# EAGLE design 0_2a (EAGLE 7.6.0)
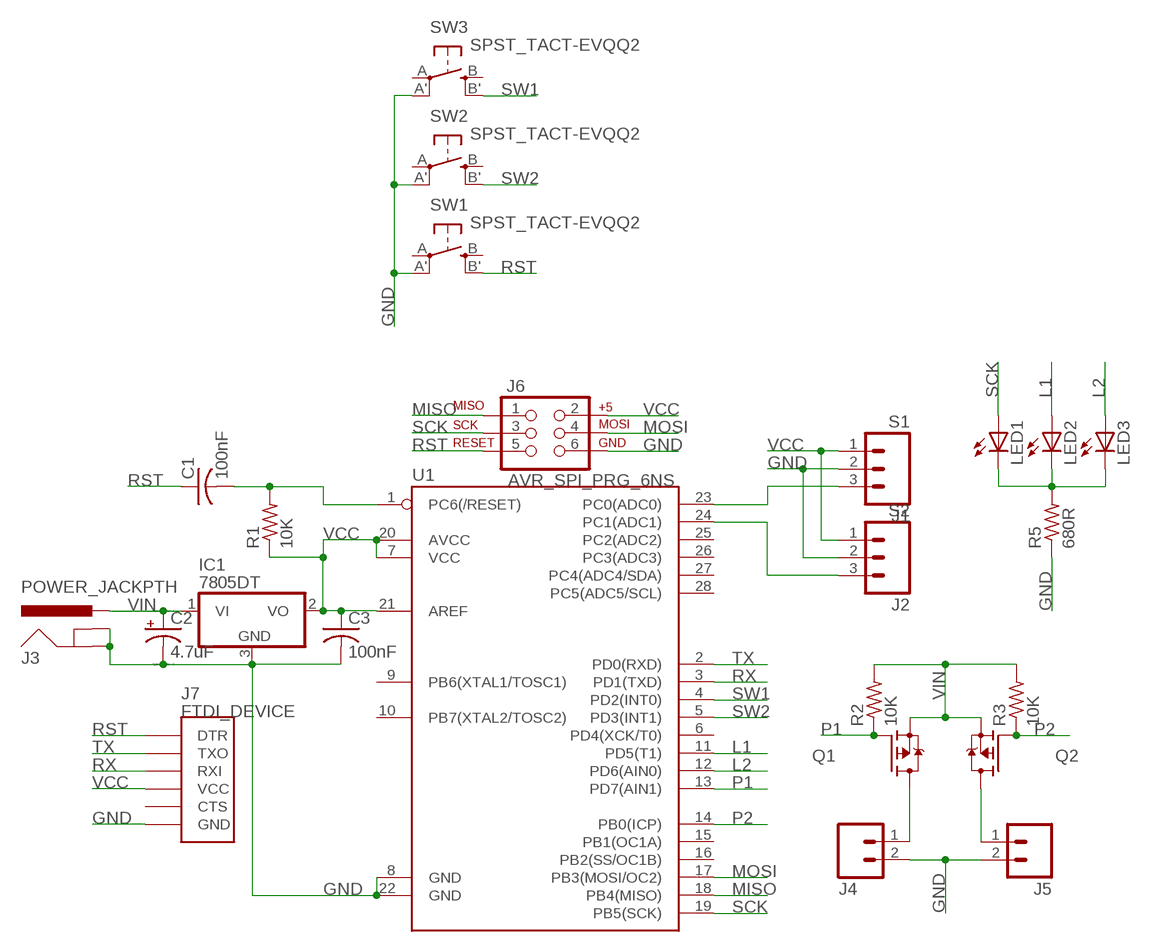
[diagram p0: schematic, sheet 1]

## Parts
C1  100nF  C-USC1206K  [C1206K]
C2  4.7uF  CPOL-US153CLV-0405  [153CLV-0405]
C3  100nF  C-USC1206K  [C1206K]
IC1  7805DT  [TO252]
J1  S1  M03POLAR  [MOLEX-1X3]
J2  S2  M03POLAR  [MOLEX-1X3]
J3  POWER_JACKPTH  [POWER_JACK_PTH]
J4  M02POLAR  [MOLEX-1X2]
J5  M02POLAR  [MOLEX-1X2]
J6  AVR_SPI_PRG_6NS  [2X3-NS]
J7  FTDI_DEVICE  [FTDI_DEVICE_SIDE]
LED1  LED3MM  [LED3MM]
LED2  LED3MM  [LED3MM]
LED3  LED3MM  [LED3MM]
Q1  FDD4141TO252  [TO252]
Q2  FDD4141TO252  [TO252]
R1  10K  R-US_R0805  [R0805]
R2  10K  R-US_R0805  [R0805]
R3  10K  R-US_R0805  [R0805]
R5  680R  R-US_R0805  [R0805]
SW1  SPST_TACT-EVQQ2  [EVQ-Q2]
SW2  SPST_TACT-EVQQ2  [EVQ-Q2]
SW3  SPST_TACT-EVQQ2  [EVQ-Q2]
U1  ATMEGA328P_PDIP  [DIL28-3]

## Nets
GND: C2.- C3.2 IC1.3(GND) J1.2 J2.2 J3.GND J3.GNDBREAK J4.2 J5.2 J6.6 J7.P$6(GND) R5.1 SW1.A'(P1) SW2.A'(P1) SW3.A'(P1) U1.8(GND) U1.22(GND)
L1: LED2.A U1.11(PD5(T1))
L2: LED3.A U1.12(PD6(AIN0))
MISO: J6.1 U1.18(PB4(MISO))
MOSI: J6.4 U1.17(PB3(MOSI/OC2))
N$1: J1.3 U1.23(PC0(ADC0))
N$2: J2.3 U1.24(PC1(ADC1))
N$3: C1.2 R1.2 U1.1(PC6(/RESET))
N$4: J4.1 Q1.3(D)
N$5: J5.1 Q2.3(D)
N$10: LED1.K(C) LED2.K(C) LED3.K(C) R5.2
P1: Q1.1(G) R2.1 U1.13(PD7(AIN1))
P2: Q2.1(G) R3.1 U1.14(PB0(ICP))
RST: C1.1 J6.5 J7.P$1(DTR) SW1.B'(S1)
RX: J7.P$3(RXI) U1.3(PD1(TXD))
SCK: J6.3 LED1.A U1.19(PB5(SCK))
SW1: SW3.B'(S1) U1.4(PD2(INT0))
SW2: SW2.B'(S1) U1.5(PD3(INT1))
TX: J7.P$2(TXO) U1.2(PD0(RXD))
VCC: C3.1 IC1.2(VO) J1.1 J2.1 J6.2 J7.P$4(VCC) R1.1 U1.7(VCC) U1.20(AVCC) U1.21(AREF)
VIN: C2.+ IC1.1(VI) J3.PWR Q1.2(S) Q2.2(S) R2.2 R3.2
Unconnected: J7.P$5(CTS) SW1.A(P) SW1.B(S) SW2.A(P) SW2.B(S) SW3.A(P) SW3.B(S) U1.6(PD4(XCK/T0)) U1.9(PB6(XTAL1/TOSC1)) U1.10(PB7(XTAL2/TOSC2)) U1.15(PB1(OC1A)) U1.16(PB2(SS/OC1B)) U1.25(PC2(ADC2)) U1.26(PC3(ADC3)) U1.27(PC4(ADC4/SDA)) U1.28(PC5(ADC5/SCL))

## Library data of the parts
C1 = rcl:C-US: CAPACITOR, American symbol
C2 = resistor:CPOL-US: POLARIZED CAPACITOR, American symbol
C3 = resistor:C-US: CAPACITOR, American symbol
IC1 = linear:78*: Positive VOLTAGE REGULATOR Source: http://cache.national.com/ds/LM/LM78L05.pdf http://www.fairchildsemi.com/ds/LM/LM7805.pdf
J1 J2 = SparkFun-Connectors:M03: Header 3 Standard 3-pin 0.1" header. Use with straight break away headers (SKU : PRT-00116), right angle break away headers (PRT-00553), swiss pins (PRT-00743), machine pins (PRT-00117), and female headers (PRT-00115). Molex polarized connector foot print use with SKU : PRT-08232 with associated crimp pins and housings.
J3 = SparkFun-Connectors:POWER_JACK: Power Jack This is the standard 5.5mm barrel jack for power. The PTH is the most common, proven, reliable, footprint. The Slot footprint only works if the mill layer is transmitted to the PCB fab house so be warned. Mating wall wart : TOL-00298 (and others); PROD_ID: CONN-08197
J4 J5 = SparkFun-Connectors:M02: Standard 2-pin 0.1" header. Use with - straight break away headers ( PRT-00116) - right angle break away headers (PRT-00553) - swiss pins (PRT-00743) - machine pins (PRT-00117) - female headers (PRT-00115) Molex polarized connector foot print use with: PRT-08233 with associated crimp pins and housings. 2.54_SCREWTERM for use with PRT-10571. 3.5mm Screw Terminal footprints for PRT-08084 5mm Screw Terminal footprints for use with PRT-08432
J6 = SparkFun-Connectors:AVR_SPI_PRG_6: AVR ISP 6 Pin This is the reduced ISP connector for AVR programming. Common on Arduino. This footprint will take up less PCB space and can be used with a 10-pin to 6-pin adapter such as SKU: BOB-08508 **Special note about "TEST_POINT" package. The stop mask is on the top side, so if you want your programming test points to be on the bottom of your board, make sure to place this package on the bottom side of the board. This also ensure that the orientation to program from the bottom side will be correct.
J7 = SparkFun-Connectors:FTDI_DEVICE: Connector which mates to FTDI basic or FTDI cable.
LED1-LED3 = led:LED: LED OSRAM: - CHIPLED LG R971, LG N971, LY N971, LG Q971, LY Q971, LO R971, LY R971 LH N974, LH R974 LS Q976, LO Q976, LY Q976 LO Q996 - Hyper CHIPLED LW Q18S LB Q993, LB Q99A, LB R99A - SideLED LS A670, LO A670, LY A670, LG A670, LP A670 LB A673, LV A673, LT A673, LW A673 LH A674 LY A675 LS A676, LA A676, LO A676, LY A676, LW A676 LS A679, LY A679, LG A679 - Hyper Micro SIDELED® LS Y876, LA Y876, LO Y876, LY Y876 LT Y87S - SmartLED LW L88C, LW L88S LB L89C, LB L89S, LG L890 LS L89K, LO L89K, LY L89K LS L896, LA L896, LO L896, LY L896 - TOPLED LS T670, LO T670, LY T670, LG T670, LP T670 LSG T670, LSP T670, LSY T670, LOP T670, LYG T670 LG T671, LOG T671, LSG T671 LB T673, LV T673, LT T673, LW T673 LH T674 LS T676, LA T676, LO T676, LY T676, LB T676, LH T676, LSB T676, LW T676 LB T67C, LV T67C, LT T67C, LS T67K, LO T67K, LY T67K, LW E67C LS E67B, LA E67B, LO E67B, LY E67B, LB E67C, LV E67C, LT E67C LW T67C LS T679, LY T679, LG T679 LS T770, LO T770, LY T770, LG T770, LP T770 LB T773, LV T773, LT T773, LW T773 LH T774 LS E675, LA E675, LY E675, LS T675 LS T776, LA T776, LO T776, LY T776, LB T776 LHGB T686 LT T68C, LB T68C - Hyper Mini TOPLED® LB M676 - Mini TOPLED Santana® LG M470 LS M47K, LO M47K, LY M47K Source: http://www.osram.convergy.de LUXEON: - LUMILED® LXK2-PW12-R00, LXK2-PW12-S00, LXK2-PW14-U00, LXK2-PW14-V00 LXK2-PM12-R00, LXK2-PM12-S00, LXK2-PM14-U00 LXK2-PE12-Q00, LXK2-PE12-R00, LXK2-PE12-S00, LXK2-PE14-T00, LXK2-PE14-U00 LXK2-PB12-K00, LXK2-PB12-L00, LXK2-PB12-M00, LXK2-PB14-N00, LXK2-PB14-P00, LXK2-PB14-Q00 LXK2-PR12-L00, LXK2-PR12-M00, LXK2-PR14-Q00, LXK2-PR14-R00 LXK2-PD12-Q00, LXK2-PD12-R00, LXK2-PD12-S00 LXK2-PH12-R00, LXK2-PH12-S00 LXK2-PL12-P00, LXK2-PL12-Q00, LXK2-PL12-R00 Source: www.luxeon.com KINGBRIGHT: KA-3528ASYC Source: www.kingbright.com
Q1 Q2 = transistor-fet:FDD4141: P-Channel PowerTrench® MOSFET Source: FDD4141.pdf
R1-R3 = rcl:R-US_: RESISTOR, American symbol
R5 = resistor:R-US_: RESISTOR, American symbol
SW1-SW3 = adafruit:SPST_TACT: SMT 6mm switch, EVQQ2 series http://www.ladyada.net/library/eagle
U1 = SparkFun-DigitalIC:ATMEGA328P_PDIP: uC used in the Arduino 32kb flash, 1k EEPROM, 2k SRAM This is the through-hole version of this chip.

## Board
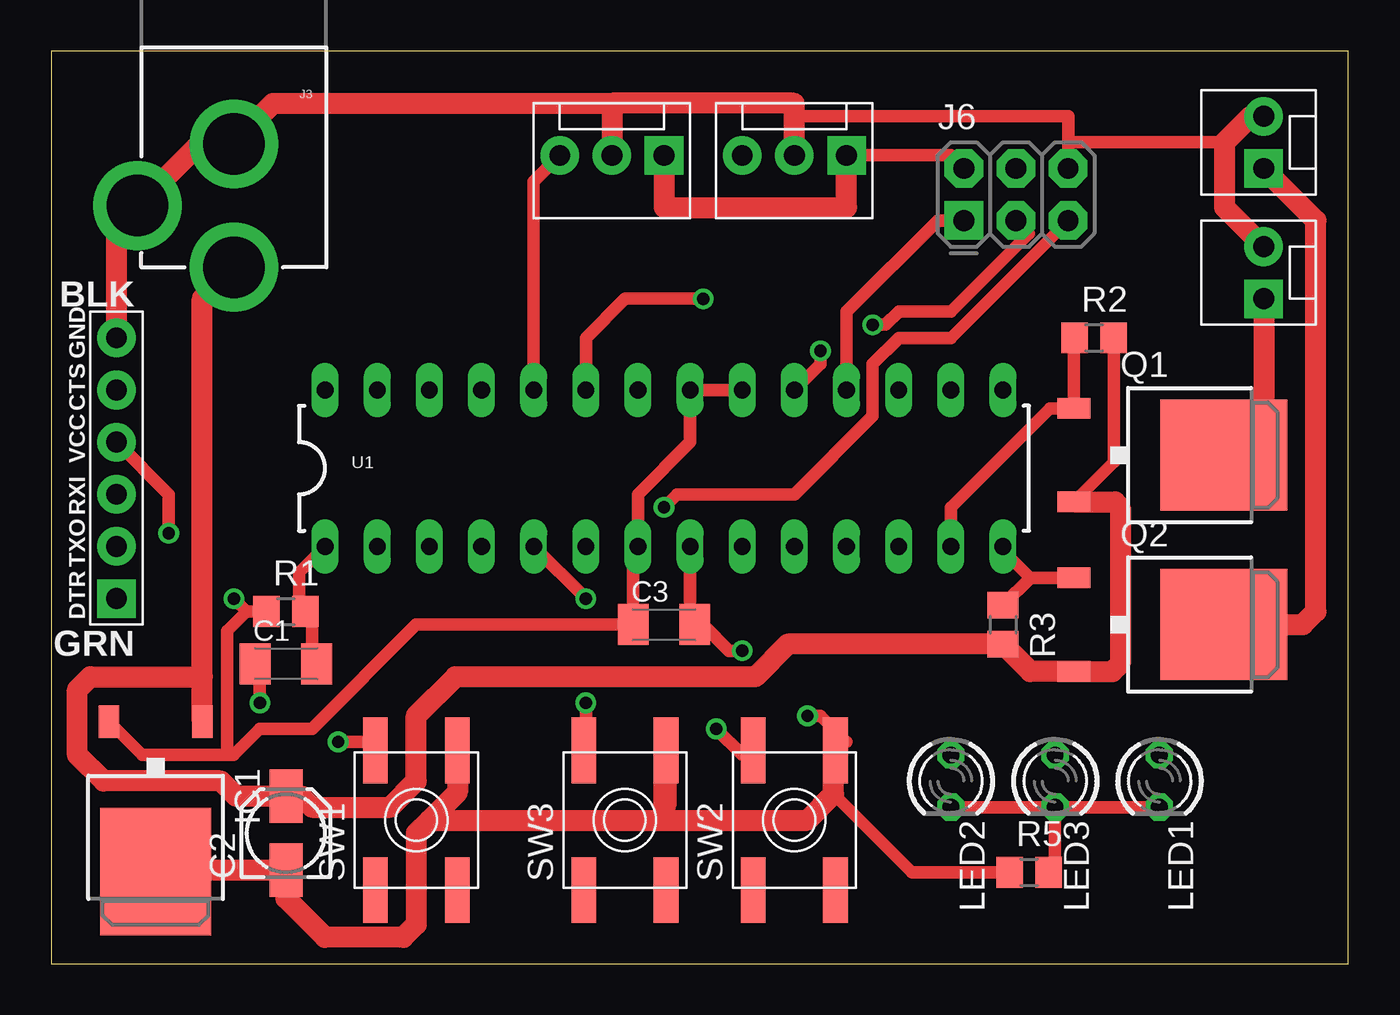
[diagram p1: board, top side]
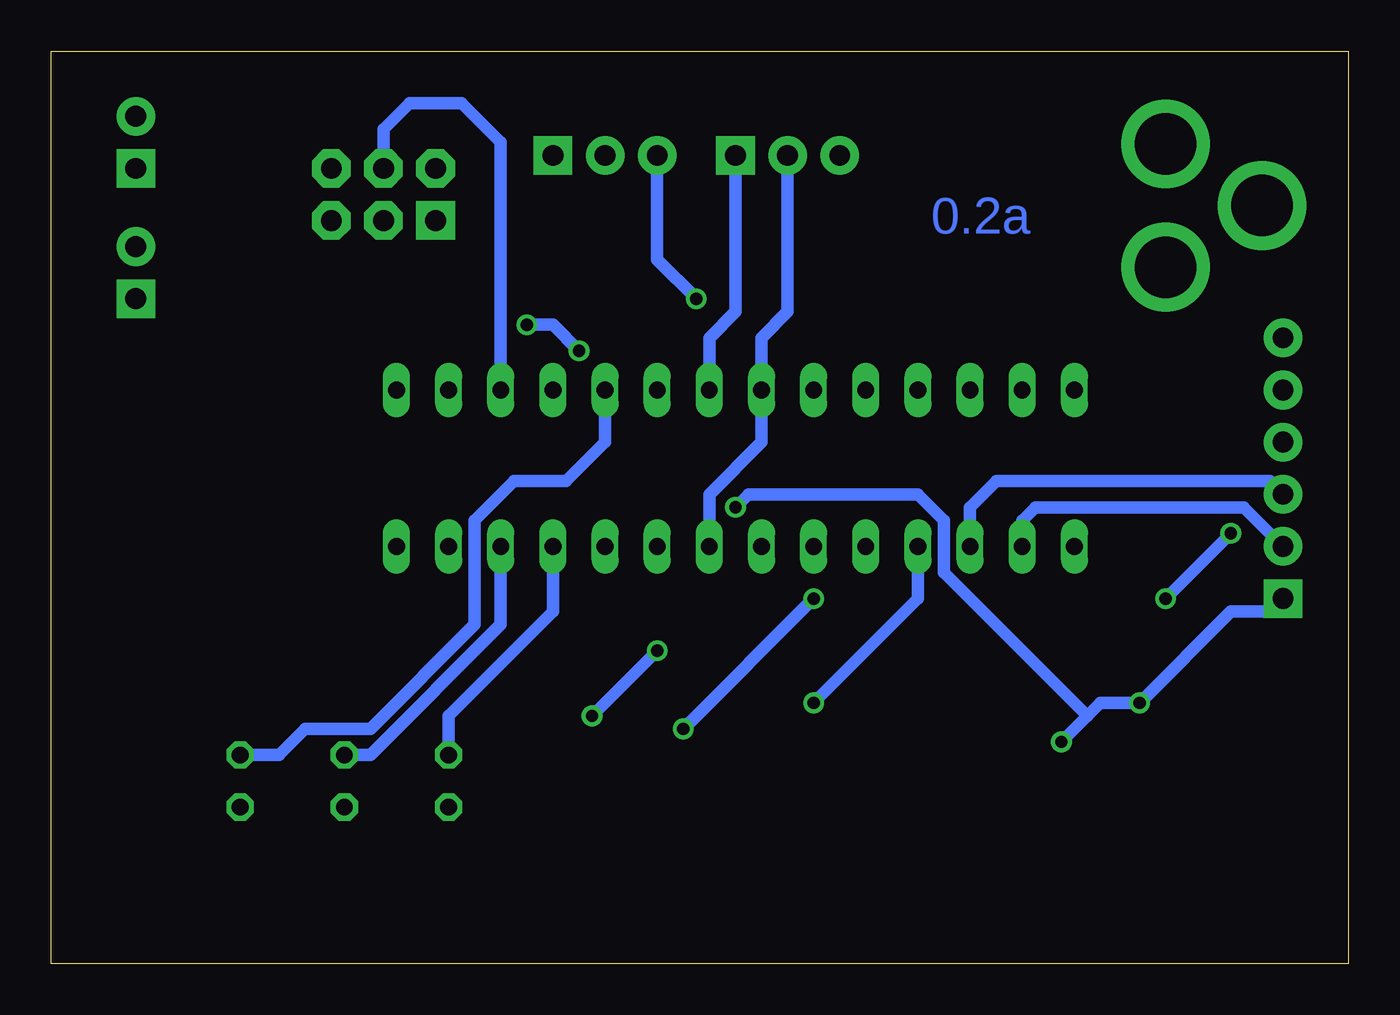
[diagram p2: board, bottom side, seen from below]

Size 63.17 x 44.44 mm. Coordinates in mm from the lower left corner, seen from the top.
Outline: 0,0 63.17,0 63.17,44.44 0,44.44 0,0
Copper layers (1*16): Top 0.035mm / dielectric 1.5mm / Bottom 0.035mm
Design rules "default": minimum track width 10mil, minimum drill 24mil, track to track 8mil, track to pad 8mil, pad to pad 8mil, via to via 8mil, smd to smd 8mil, copper to edge 40mil, drill to drill 8mil, minimum pad ring 10mil, minimum via ring 8mil, stop-mask expansion 4mil, vias tented up to drill 0mil, thermal gap 10mil

### Footprints (pad centres in the part's own frame; a part is rotated, then mirrored left to right if it is on the bottom)
C1206K = smd 1.5 x 2: 1 -1.5,0; 2 1.5,0
153CLV-0405 = smd 2.6 x 1.6: + 1.8,0; - -1.8,0
TO252 = smd 1 x 1.6: 1 -2.28,-4.8; 2 2.28,-4.8 | smd 5.4 x 6.2: 3 0,2.5
MOLEX-1X3 = drill 1.016 pad 1.88 square: 1 0,0 | drill 1.016 pad 1.88: 2 2.54,0; 3 5.08,0
POWER_JACK_PTH = drill 2.997 pad 4.318: GND 0,7.7; GNDBREAK 4.7,10.7; PWR 0,13.7
MOLEX-1X2 = drill 1.016 pad 1.88 square: 1 0,0 | drill 1.016 pad 1.88: 2 2.54,0
2X3-NS = drill 1.016 pad 1.88 square: 1 -2.54,-1.27 | drill 1.016 pad 1.88 octagon: 2 -2.54,1.27; 3 0,-1.27; 4 0,1.27; 5 2.54,-1.27; 6 2.54,1.27
FTDI_DEVICE_SIDE = drill 1.016 pad 1.88 square: P$1 -6.35,0 | drill 1.016 pad 1.88: P$2 -3.81,0; P$3 -1.27,0; P$4 1.27,0; P$5 3.81,0; P$6 6.35,0
LED3MM = drill 0.813 octagon: A -1.27,0; K 1.27,0
R0805 = smd 1.3 x 1.5: 1 -0.95,0; 2 0.95,0
EVQ-Q2 = smd 3.2 x 1.2: A -3.4,-2; A' 3.4,-2; B -3.4,2; B' 3.4,2
DIL28-3 = drill 0.813 long: 1 -16.51,-3.81; 2 -13.97,-3.81; 3 -11.43,-3.81; 4 -8.89,-3.81; 5 -6.35,-3.81; 6 -3.81,-3.81; 7 -1.27,-3.81; 8 1.27,-3.81; 9 3.81,-3.81; 10 6.35,-3.81; 11 8.89,-3.81; 12 11.43,-3.81; 13 13.97,-3.81; 14 16.51,-3.81; 15 16.51,3.81; 16 13.97,3.81; 17 11.43,3.81; 18 8.89,3.81; 19 6.35,3.81; 20 3.81,3.81; 21 1.27,3.81; 22 -1.27,3.81; 23 -3.81,3.81; 24 -6.35,3.81; 25 -8.89,3.81; 26 -11.43,3.81; 27 -13.97,3.81; 28 -16.51,3.81

### Placement (x,y rotation side)
C1  11.43,14.61 0 top
C2  11.43,6.35 90 top
C3  29.84,16.51 0 top
IC1  5.08,6.98 180 top
J1  38.73,39.37 180 top
J2  29.84,39.37 180 top
J3  8.89,47.62 180 top
J4  59.05,32.39 90 top
J5  59.05,38.73 90 top
J6  46.99,37.47 0 top
J7  3.17,24.13 90 top
LED1  53.98,8.89 270 top
LED2  43.82,8.89 270 top
LED3  48.9,8.89 270 top
Q1  54.61,24.77 270 top
Q2  54.61,16.51 270 top
R1  11.43,17.14 0 top
R2  50.8,30.48 0 top
R3  46.36,16.51 270 top
R5  47.62,4.45 0 top
SW1  17.78,6.98 90 top
SW2  36.2,6.98 90 top
SW3  27.94,6.98 90 top
U1  29.84,24.13 0 top

### Tracks (layer width: path | path; a pad name or v marks a point on that pad's centre or on a via)
GND  (via drill 0.6)
  Top 0.61: U1.8 31.11,16.51 C3.2 31.75,16.51 33.02,15.24 v33.66,15.24 | R5.1 41.91,4.45 38.1,8.25 | v36.83,12.07 37.47,12.07 38.73,10.8 SW2.A' | J6.6 49.53,40 | 49.53,40 49.53,41.28 36.2,41.28 | 57.15,40 49.53,40
  Top 1.016: J7.P$6 3.17,35.91 J3.GNDBREAK 7.19,39.92 J3.GND 8.89,40 10.79,41.91 27.3,41.91 | 27.3,41.91 J2.2 | J1.2 36.2,41.28 36.2,41.91 27.3,41.91 | 18.41,6.98 17.78,6.35 17.78,1.91 17.14,1.27 13.34,1.27 11.43,3.18 C2.- 5.15,4.55 IC1.3 | SW1.A' 19.78,8.35 18.41,6.98 | 18.41,6.98 29.84,6.98 | 29.84,7.62 29.84,10.29 SW3.A' 29.94,7.71 29.84,7.62 | 29.84,7.62 29.84,6.98 | 29.84,6.98 36.83,6.98 38.1,8.25 38.1,10.29 SW2.A' | J5.2 58.42,41.28 57.15,40 57.15,36.83 J4.2
  Bottom 0.61: J2.2 27.3,31.75 28.57,30.48 U1.22 28.57,25.4 31.11,22.86 U1.8 | v36.83,12.07 v33.66,15.24
L1
  Bottom 0.61: LED2.A 43.82,12.07 38.73,17.14 U1.11
L2
  Bottom 0.61: LED3.A 47.62,10.16 41.27,16.51 U1.12
MISO
  Top 0.61: J6.1 43.18,36.2 38.73,31.75 U1.18
MOSI
  Bottom 0.61: J6.4 46.99,40.64 45.72,41.91 43.18,41.91 41.27,40 U1.17
N$1  (via drill 0.6)
  Top 0.61: v31.75,32.39 27.94,32.39 26.04,30.48 U1.23
  Bottom 0.61: J1.3 33.66,34.29 v31.75,32.39
N$2
  Top 0.61: U1.24 23.49,38.1 J2.3
N$3
  Top 0.61: C1.2 12.7,14.61 12.7,17.14 R1.2 12.06,17.14 12.06,19.05 U1.1
N$4
  Top 1.016: J4.1 59.05,26.71 Q1.3
N$5
  Top 1.016: Q2.3 60.96,16.51 61.59,17.14 61.59,36.2 J5.1
N$10
  Top 0.61: LED3.K 48.9,4.77 R5.2 | LED3.K LED2.K | LED3.K LED1.K
P1
  Top 0.61: U1.13 43.82,22.22 48.64,27.04 Q1.1 49.81,30.44 R2.1
P2
  Top 0.61: Q2.1 47.69,18.79 | 47.69,18.79 R3.1 | U1.14 46.36,20.12 47.69,18.79
RST  (via drill 0.6)
  Top 0.61: v10.16,12.7 10.16,14.61 C1.1 | v13.97,10.8 15.24,10.8 SW1.B' | J6.5 43.82,30.48 41.27,30.48 40.01,29.21 40.01,26.67 36.2,22.86 30.48,22.86 v29.84,22.22
  Bottom 0.61: J7.P$1 3.81,17.14 5.71,17.14 v10.16,12.7 12.06,12.7 12.7,12.07 | v13.97,10.8 12.7,12.07 | v29.84,22.22 29.21,22.86 20.95,22.86 19.68,21.59 19.68,19.05 12.7,12.07
RX
  Bottom 0.61: U1.3 18.41,22.22 17.14,23.5 3.81,23.5 J7.P$3
SCK  (via drill 0.6)
  Top 0.61: U1.19 37.47,29.21 v37.47,29.85 | v40.01,31.11 40.64,31.11 41.27,31.75 43.82,31.75 47.62,35.56 J6.3
  Bottom 0.61: LED1.A 52.07,10.16 50.8,11.43 47.62,11.43 42.55,16.51 42.55,21.59 40.64,23.5 38.1,23.5 36.2,25.4 U1.19 | v37.47,29.85 38.73,31.11 v40.01,31.11
SW1  (via drill 0.6)
  Top 0.61: v26.04,12.7 26.04,10.8 SW3.B'
  Bottom 0.61: U1.4 20.95,17.78 v26.04,12.7
SW2  (via drill 0.6)
  Top 0.61: v26.04,17.78 U1.5 | v32.39,11.43 33.66,10.16 SW2.B'
  Bottom 0.61: v32.39,11.43 v26.04,17.78
TX
  Bottom 0.61: U1.2 15.88,21.59 15.24,22.22 5.08,22.22 J7.P$2
VCC  (via drill 0.6)
  Top 0.61: U1.20 U1.21 31.11,25.4 28.57,22.86 U1.7 28.34,20.09 C3.1 17.78,16.51 12.7,11.43 10.16,11.43 8.89,10.16 8.57,10.16 | 8.57,10.16 4.42,10.16 IC1.2 | 8.57,10.16 8.57,16.19 9.53,17.14 | 9.53,17.14 R1.1 | J7.P$4 5.71,22.86 v5.71,20.96 | 9.53,17.14 v8.89,17.78 | J1.1 43.82,39.37 J6.2
  Top 1.016: J2.1 29.84,36.83 38.73,36.83 J1.1
  Bottom 0.61: J2.1 29.84,31.75 31.11,30.48 U1.21 | v8.89,17.78 v5.71,20.96
VIN
  Top 0.61: R2.2 51.75,24.43 Q1.2
  Top 1.016: IC1.1 7.36,13.97 | 7.36,13.97 7.36,32.39 J3.PWR | Q1.2 51.81,22.49 52.07,22.22 52.07,14.61 51.7,14.23 Q2.2 47.69,14.23 R3.2 35.88,15.56 34.29,13.97 19.68,13.97 17.78,12.07 17.78,8.89 16.51,7.62 12.7,7.62 12.17,8.15 C2.+ 9,8.15 8.26,8.89 2.54,8.89 1.27,10.16 1.27,13.34 1.91,13.97 7.36,13.97

### Text on the board
Bottom: 0.2a
bStop: 0.2a